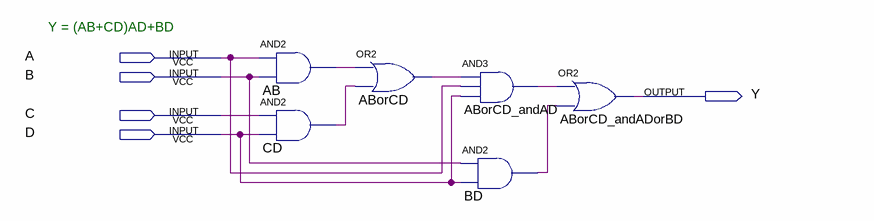
[diagram p0: schematic sheet]
// Quartus schematic Prac1.bdf as structural Verilog: 6 symbols, 5 pins
module Prac1 (
  input  A,
  input  B,
  input  C,
  input  D,
  output Y
);

  wire AB_out, ABorCD_andAD_out, ABorCD_out, BD_out, CD_out;

  and AB (AB_out, A, B);
  and CD (CD_out, C, D);
  or ABorCD (ABorCD_out, AB_out, CD_out);
  and ABorCD_andAD (ABorCD_andAD_out, ABorCD_out, A, D);
  and BD (BD_out, B, D);
  or ABorCD_andADorBD (Y, ABorCD_andAD_out, BD_out);

  // Notes on the sheet:
  //   Y = (AB+CD)AD+BD
endmodule
